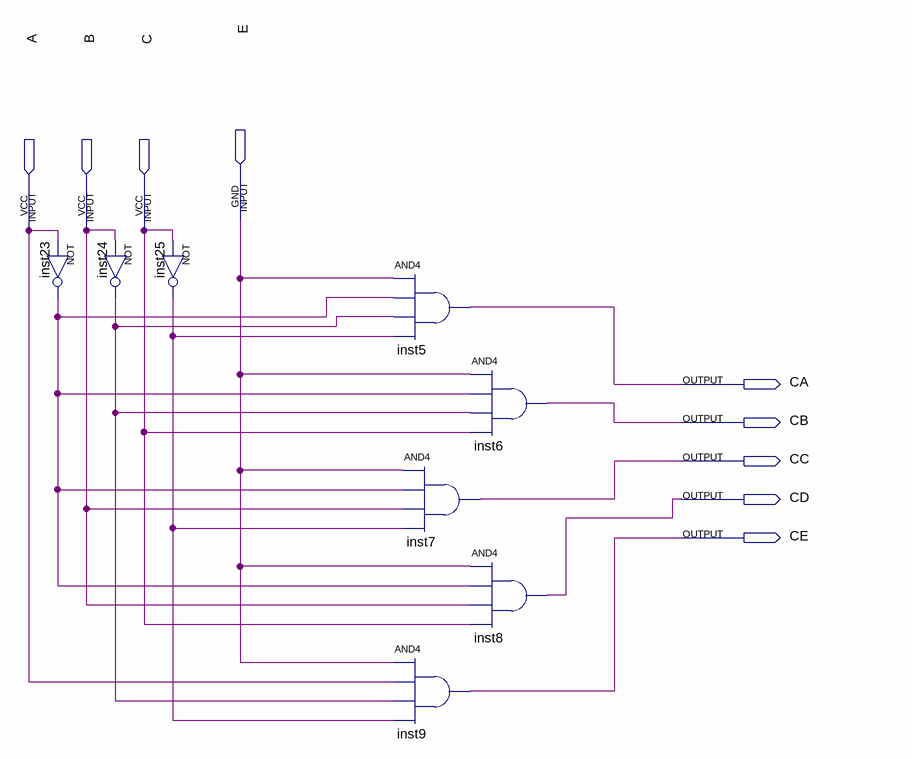
[diagram p0: schematic sheet]
// Quartus schematic DECODIFICADOR_COLUNAS.bdf as structural Verilog: 8 symbols, 9 pins
module DECODIFICADOR_COLUNAS (
  input  E,
  input  A,
  input  B,
  input  C,
  output CA,
  output CB,
  output CC,
  output CD,
  output CE
);

  wire inst23_out, inst24_out, inst25_out;

  not inst23 (inst23_out, A);
  not inst24 (inst24_out, B);
  not inst25 (inst25_out, C);
  and inst5 (CA, E, inst23_out, inst24_out, inst25_out);
  and inst7 (CC, E, inst23_out, B, inst25_out);
  and inst9 (CE, E, A, inst24_out, inst25_out);
  and inst6 (CB, E, inst23_out, inst24_out, C);
  and inst8 (CD, E, inst23_out, B, C);
endmodule
